# EAGLE schematic charlieplex20_minres (EAGLE 6.5.0)
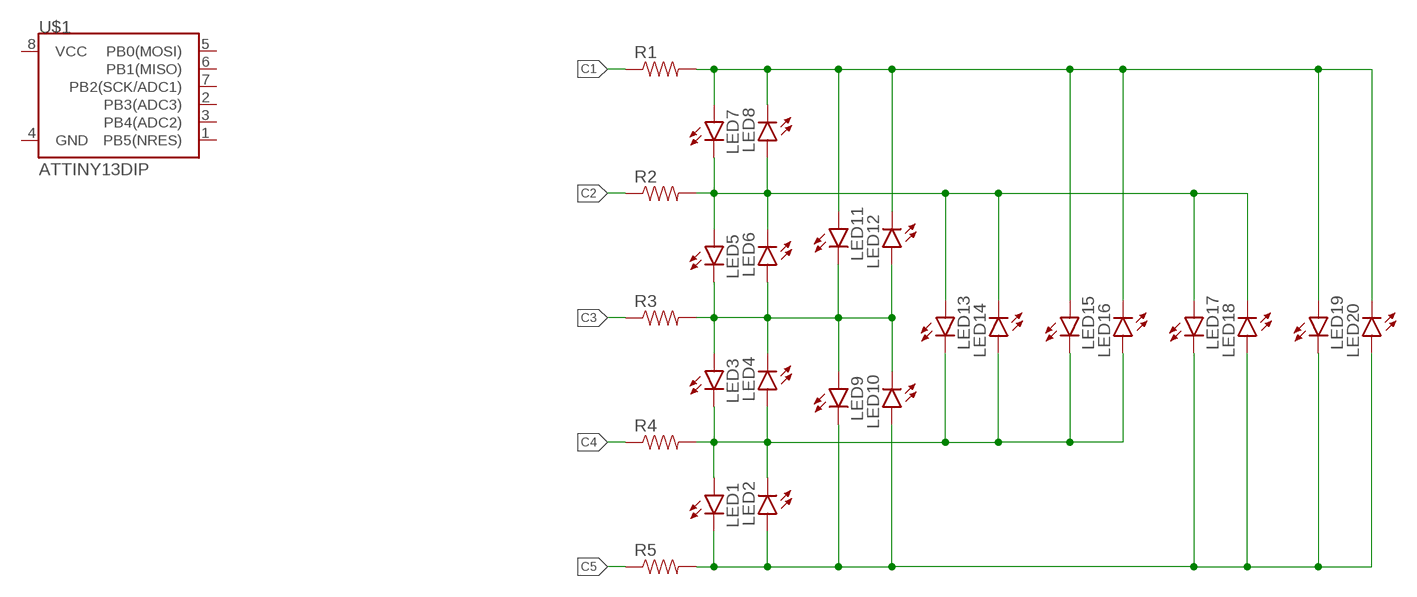
[diagram p0: schematic, sheet 1]

## Parts
LED1  LED0603  [LED-0603]
LED2  LED0603  [LED-0603]
LED3  LED0603  [LED-0603]
LED4  LED0603  [LED-0603]
LED5  LED0603  [LED-0603]
LED6  LED0603  [LED-0603]
LED7  LED0603  [LED-0603]
LED8  LED0603  [LED-0603]
LED9  LED0603  [LED-0603]
LED10  LED0603  [LED-0603]
LED11  LED0603  [LED-0603]
LED12  LED0603  [LED-0603]
LED13  LED0603  [LED-0603]
LED14  LED0603  [LED-0603]
LED15  LED0603  [LED-0603]
LED16  LED0603  [LED-0603]
LED17  LED0603  [LED-0603]
LED18  LED0603  [LED-0603]
LED19  LED0603  [LED-0603]
LED20  LED0603  [LED-0603]
R1  RESISTOR0603-RES  [0603-RES]
R2  RESISTOR0603-RES  [0603-RES]
R3  RESISTOR0603-RES  [0603-RES]
R4  RESISTOR0603-RES  [0603-RES]
R5  RESISTOR0603-RES  [0603-RES]
U$1  ATTINY13DIP  [DIP08]

## Nets
C1: LED7.A LED8.C LED11.A LED12.C LED15.A LED16.C LED19.A LED20.C R1.1 R1.2
C2: LED5.A LED6.C LED7.C LED8.A LED13.A LED14.C LED17.A LED18.C R2.1 R2.2
C3: LED3.A LED4.C LED5.C LED6.A LED9.A LED10.C LED11.C LED12.A R3.1 R3.2
C4: LED1.A LED2.C LED3.C LED4.A LED13.C LED14.A LED15.C LED16.A R4.1 R4.2
C5: LED1.C LED2.A LED9.C LED10.A LED17.C LED18.A LED19.C LED20.A R5.1 R5.2
Unconnected: U$1.1(PB5(NRES)) U$1.2(PB3(ADC3)) U$1.3(PB4(ADC2)) U$1.4(GND) U$1.5(PB0(MOSI)) U$1.6(PB1(MISO)) U$1.7(PB2(SCK/ADC1)) U$1.8(VCC)

## Library data of the parts
LED1-LED20 = SparkFun-LED:LED: LEDs Standard schematic elements and footprints for 5mm, 3mm, 1206, and 0603 sized LEDs. 5mm - Spark Fun Electronics SKU : COM-00529 (and others)
R1-R5 = SparkFun-Resistors:RESISTOR: Resistor Basic schematic elements and footprints for 0603, 1206, and PTH resistors.
U$1 = SparkFun-DigitalIC:ATTINY13: Atmel 8-pin 1kB flash uC